# Altium project F4_Flight_Controller.PrjPcb
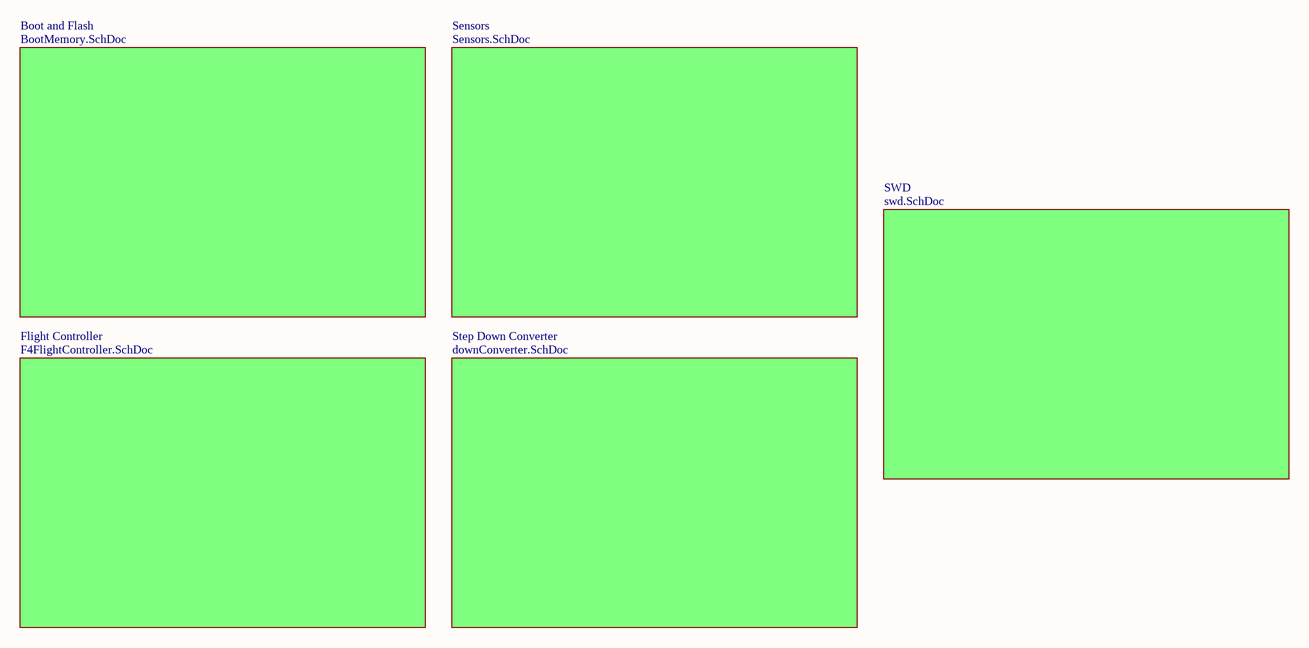
[diagram p0: Index.SchDoc]
6 sheets, 73 parts. Net scope: flat (ports and power ports of the same name join across sheets).
Board file: PCB1.PcbDoc
Sheets:
  Index.SchDoc
    Boot and Flash = BootMemory.SchDoc
    Sensors = Sensors.SchDoc
    Flight Controller = F4FlightController.SchDoc
    Step Down Converter = downConverter.SchDoc
    SWD = swd.SchDoc

## Sheet Index.SchDoc
size A4

### Sub-sheets
Boot and Flash = BootMemory.SchDoc: no entries
Flight Controller = F4FlightController.SchDoc: no entries
Sensors = Sensors.SchDoc: no entries
Step Down Converter = downConverter.SchDoc: no entries
SWD = swd.SchDoc: no entries

## Sheet BootMemory.SchDoc
size A4
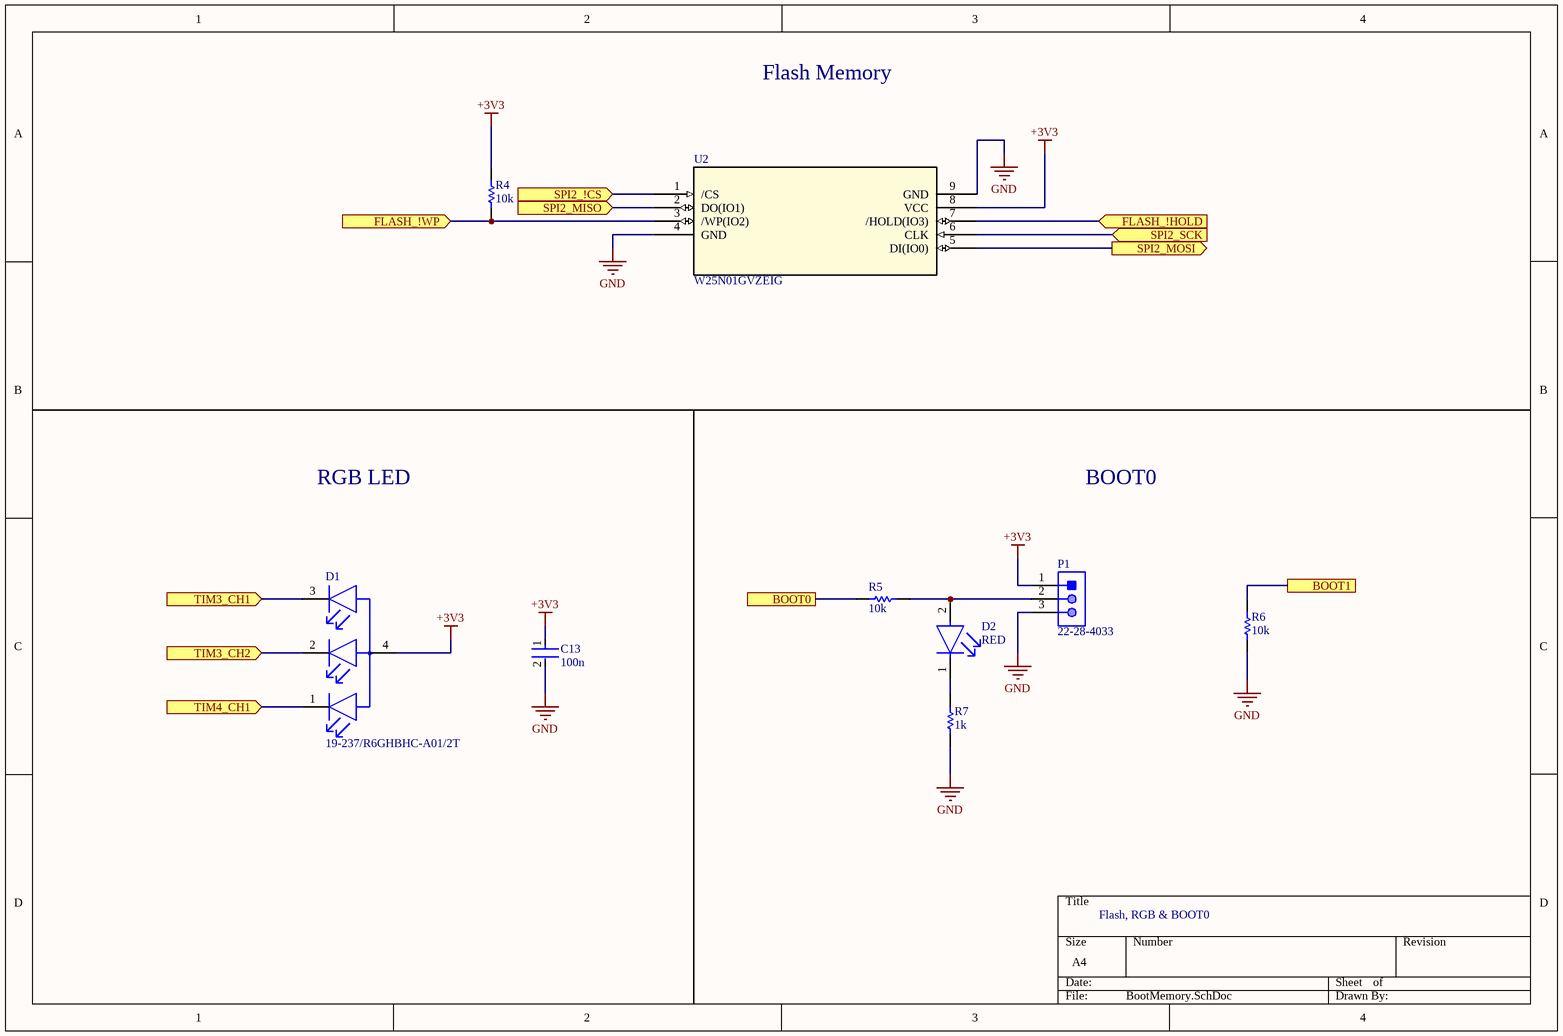
[diagram p1: BootMemory.SchDoc]

### Parts
C13  100n  [Capacitor 0402]
D1  19-237/R6GHBHC-A01/2T  [19337R6GHBHCA012T]
D2  RED  [FP-LTST-C190GKT-MFG]
P1  22-28-4033  [HDRV10W90P254_1X3_1270X483X840P]
R4  10k  [Resistor 0402]
R5  10k  [Resistor 0402]
R6  10k  [Resistor 0402]
R7  1k  [Resistor 0402]
U2  W25N01GVZEIG  [SON127P800X600X80-9N-D]

### Ports
BOOT0, BOOT1, FLASH_!HOLD (in), FLASH_!WP (in), SPI2_!CS (in), SPI2_MISO (in), SPI2_MOSI (out), SPI2_SCK (in), TIM3_CH1 (in), TIM3_CH2 (in), TIM4_CH1 (in)

### Nets
+3V3: C13.1 D1.4(COMMON_ANODE) P1.1 R4.2 U2.8(VCC)
GND: C13.2 P1.3 R6.2 R7.2 U2.4(GND) U2.9(GND)
BOOT0: R5.2 ; port BOOT0
BOOT1: R6.1 ; port BOOT1
FLASH_!HOLD: U2.7(/HOLD(IO3)) ; port FLASH_!HOLD
FLASH_!WP: R4.1 U2.3(/WP(IO2)) ; port FLASH_!WP
SPI2_!CS: U2.1(/CS) ; port SPI2_!CS
SPI2_MISO: U2.2(DO(IO1)) ; port SPI2_MISO
SPI2_MOSI: U2.5(DI(IO0)) ; port SPI2_MOSI
SPI2_SCK: U2.6(CLK) ; port SPI2_SCK
TIM3_CH1: D1.3(BLUE_C) ; port TIM3_CH1
TIM3_CH2: D1.2(GREEN_C) ; port TIM3_CH2
TIM4_CH1: D1.1(RED_C) ; port TIM4_CH1
NetD2_1: D2.1(C) R7.1
NetD2_2: D2.2(A) P1.2 R5.1

### Notes on the sheet
- Flash Memory
- RGB LED
- BOOT0
- Flash, RGB & BOOT0

### Library data of the parts
C13 = Capacitor 0402: Chip Capacitor 0402; Manufacturer Part Number: CC0402KRX7R7BB103; Manufacturer: Yageo; Automotive Grade: NA; Capacitance: 10 nF; Material: Ceramic; Value: 10 nF; Tolerance: 0.1; Temperature Characteristic: X7R; Voltage Rating: 16 V; Temperature Coefficient: 30ppm/°C; Temperature Range Low: -55°C; Temperature Range High: +125°C; Mouser Description: 0402 10 nF 16 V ±10 % Tolerance X7R SMT Multilayer Ceramic Capacitor; Footprint Url: http://www.yageo.com/exep/pages/download/literatures/UPY-C_GEN_24.pdf; Category: Cap; RoHS: TRUE; ComponentLink2Description: Datasheet; Ipc Land Pattern Name: CAPC10050X50; Automotive: No; ComponentLink2URL: http://www.yageo.com/documents/recent/UPY-GP_NP0_16V-to-50V_16.pdf; Device Class L1: Passive Components; Height: 0.55mm; Package: CC0402; Device Class L3: Ceramic Capacitors; Lead Free: Yes; Device Class L2: Capacitors; Digikey Description: CAP CER 10000PF 16V X7R 0402; Octopart: https://octopart.com/cc0402krx7r7bb103-yageo-192895; Temperature: -55°C to +125°C
D1 = LED RGB: LED RGB CLEAR CHIP SMD R/A; Manufacturer: Everlight; Manufacturer Part Number: 12-23A/R6GHBHC-A01/2D; Colour: Red, Green, Blue; Forward Current: 20mA; Forward Voltage: 2/3.3/3.3V; Viewing Angle: 120°; Led Orientation: Side View; Luminous Intensity: 90/180/72mcd; Wavelength: 624/525/470nm; Reverse Voltage: 5V; Peak Emmision Wavelength: 632/518/468nm; Power Dissipation: 60/110/110mW; Digikey Description: LED RGB CLEAR CHIP SMD R/A; Octopart: https://octopart.com/12-23a%2Fr6ghbhc-a01%2F2d-everlight-10561613; ComponentLink2Description: Datasheet; Lead Free: Yes; Device Class L2: LEDs; Automotive: No; Mouser Description: Standard LEDs - SMD RGB WATER CLEAR RIGHT ANGLE LENS; Category: Diode; Device Class L3: unset; Temperature Range Low: -40°C; Package: 12-23A; Device Class L1: Optoelectronics; Temperature Range High: +85°C; Height: 2.1mm; RoHS: TRUE; Temperature: -40°C to +85°C; ComponentLink2URL: https://media.digikey.com/pdf/Data%20Sheets/Everlight%20PDFs/12-23A,R6GHBHC-A01,2D.pdf
D2 = CMP-22017-000005-1: LED GREEN CLEAR CHIP SMD; Reverse Voltage: 5V; Power Dissipation: 100mW; Forward Voltage: 2.1V; Test Current: 10mA; Number of LEDs: 1; Viewing Angle: 130°; Forward Current: 30mA; Voltage: 2V; Wavelength: 565nm; Dominant Wavelength: 569nm; Luminous Intensity: 6mcd; Lens Color: Colorless; Packaging: Tape and Reel; Lens Transparency: Clear; Min Operating Temperature: -55°C; Case Code (Metric): 1608; Lens Style: Clear; Case/Package: 0603; Mount: Surface Mount; Package Quantity: 1; Height: 0.8mm; Illumination Color: Green; Radiation Hardening: No; Depth: 0.8mm; Number of Pins: 2; Max Operating Temperature: 85°C; Color: Green; Number of Elements: 1; Power Rating: 100mW; Case Code (Imperial): 0603; Width: 0.8mm; Length: 1.6mm; Lead Free: Lead Free
P1 = Male Header 01x03: Male Header, Pitch 2.54 mm, 1 x 3 Position, Height 8.38 mm, Tail Length 3.18 mm, RoHS, Bulk; Manufacturer: Molex; Rows: 1; Voltage Rating: 250 V; Current Rating: 4 A; Min Operating Temperature: 0 degC; Lead Pitch: 0.1 inch; Packaging: Bulk; Contact Finish: Gold; RoHSCompliant: true; Contact Material: Brass; PackageReference: 22-28-4033; REACH SVHC: Unknown; PackageDescription: Male Header, Pitch 2.54 mm, 1 x 3 Position, Height 8.38 mm, Tail Length 3.18 mm; ComponentLink2URL: http://www.molex.com/pdm_docs/sd/022284033_sd.pdf; Height: 8.38 mm; Mounting Technology: Through Hole; ComponentLink1Description: Manufacturer URL; Length: 7.62 mm; Mount: Through Hole; DatasheetVersion: Rev. G, 01/2012; Max Operating Temperature: 75 degC; ComponentLink2Description: Datasheet; Colour: Black; Pins: 3; Contact Plating: Gold; Package Quantity: 1; ComponentLink1URL: http://www.molex.com/; Manufacturer Part Number: 22-28-4033
R4-R7 = Resistor 0402: Chip Resistor 0402; Manufacturer: Vishay; Part Number: CRCW0402120RFKED; Manufacturer Part Number: CRCW0402120RFKED
U2 = W25N01GVZEIG: Flash memory; Vendor: Winbond; Built_By: EMA_Cory; SourceLibrary: Winbond_2020-02-06; Datasheet: https://www.winbond.com/resource-files/w25n01gv%20revl%20050918%20unsecured.pdf; Manufacturer_Part_Number: W25N01GVZEIG; Copyright: Copyright (C) 2018 Accelerated Designs. All rights reserved; RefDes: RefDes; Type: DEV

## Sheet Sensors.SchDoc
size A4
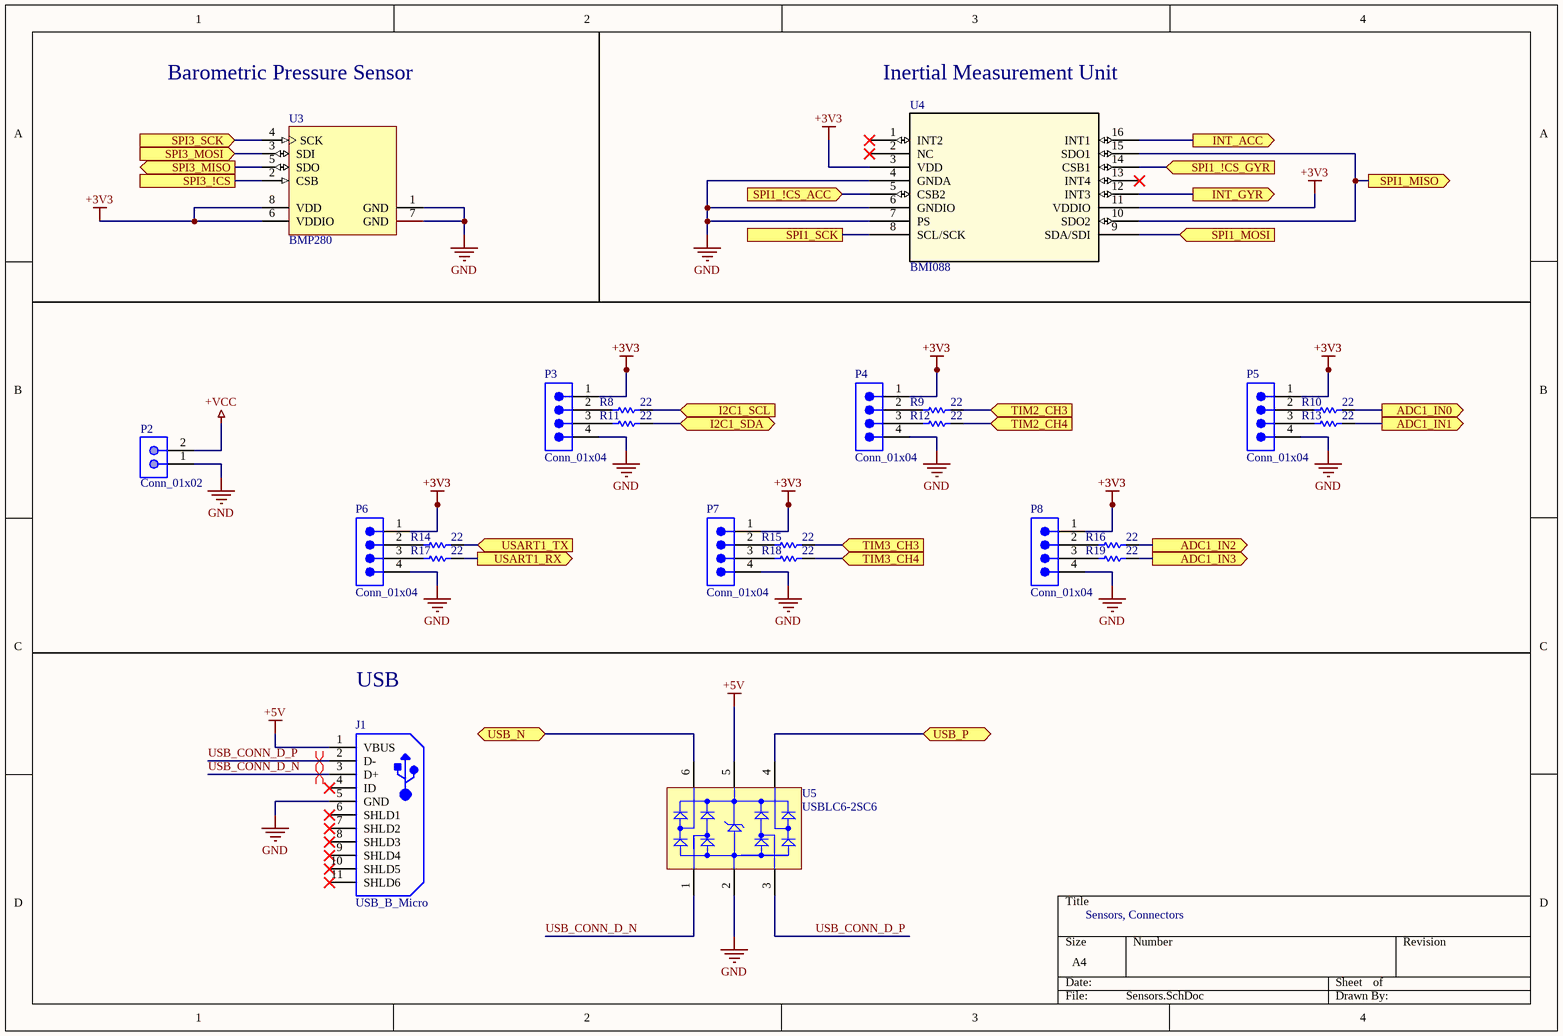
[diagram p2: Sensors.SchDoc]

### Parts
J1  USB_B_Micro  [MOLX-105133-0001_V]
P2  Conn_01x02  [HDRV10W90P254_1X2_1270X483X840P]
P3  Conn_01x04  [HDRV10W90P254_1X4_1270X483X840P]
P4  Conn_01x04  [HDRV10W90P254_1X4_1270X483X840P]
P5  Conn_01x04  [HDRV10W90P254_1X4_1270X483X840P]
P6  Conn_01x04  [HDRV10W90P254_1X4_1270X483X840P]
P7  Conn_01x04  [HDRV10W90P254_1X4_1270X483X840P]
P8  Conn_01x04  [HDRV10W90P254_1X4_1270X483X840P]
R8  22  [Resistor 0402]
R9  22  [Resistor 0402]
R10  22  [Resistor 0402]
R11  22  [Resistor 0402]
R12  22  [Resistor 0402]
R13  22  [Resistor 0402]
R14  22  [Resistor 0402]
R15  22  [Resistor 0402]
R16  22  [Resistor 0402]
R17  22  [Resistor 0402]
R18  22  [Resistor 0402]
R19  22  [Resistor 0402]
U3  BMP280  [8-PIN-METAL-LID-LGA]
U4  BMI088  [BMI088]
U5  USBLC6-2SC6  [SOT95P280X145-6N]

### Ports
ADC1_IN0 (out), ADC1_IN1 (out), ADC1_IN2 (out), ADC1_IN3 (out), I2C1_SCL (in), I2C1_SDA (bidir), INT_ACC (out), INT_GYR (out), SPI1_!CS_ACC (in), SPI1_!CS_GYR (in), SPI1_MISO (out), SPI1_MOSI (in), SPI1_SCK, SPI3_!CS, SPI3_MISO (out), SPI3_MOSI (in), SPI3_SCK (in), TIM2_CH3 (in), TIM2_CH4 (in), TIM3_CH3 (in), TIM3_CH4 (in), USART1_RX (out), USART1_TX (in), USB_N (bidir), USB_P (bidir)

### Nets
+3V3: P3.1 P4.1 P5.1 P6.1 P7.1 P8.1 U3.6(VDDIO) U3.8(VDD) U4.3(VDD) U4.11(VDDIO)
+5V: J1.1(VBUS) U5.5(VBUS)
+VCC: P2.2
GND: J1.5(GND) P2.1 P3.4 P4.4 P5.4 P6.4 P7.4 P8.4 U3.1(GND) U3.7(GND) U4.4(GNDA) U4.6(GNDIO) U4.7(PS) U5.2(GND)
ADC1_IN0: R10.1 ; port ADC1_IN0
ADC1_IN1: R13.1 ; port ADC1_IN1
ADC1_IN2: R16.1 ; port ADC1_IN2
ADC1_IN3: R19.1 ; port ADC1_IN3
I2C1_SCL: R8.1 ; port I2C1_SCL
I2C1_SDA: R11.1 ; port I2C1_SDA
INT_ACC: U4.16(INT1) ; port INT_ACC
INT_GYR: U4.12(INT3) ; port INT_GYR
SPI1_!CS_ACC: U4.5(CSB2) ; port SPI1_!CS_ACC
SPI1_!CS_GYR: U4.14(CSB1) ; port SPI1_!CS_GYR
SPI1_MISO: U4.10(SDO2) U4.15(SDO1) ; port SPI1_MISO
SPI1_MOSI: U4.9(SDA/SDI) ; port SPI1_MOSI
SPI1_SCK: U4.8(SCL/SCK) ; port SPI1_SCK
SPI3_!CS: U3.2(CSB) ; port SPI3_!CS
SPI3_MISO: U3.5(SDO) ; port SPI3_MISO
SPI3_MOSI: U3.3(SDI) ; port SPI3_MOSI
SPI3_SCK: U3.4(SCK) ; port SPI3_SCK
TIM2_CH3: R9.1 ; port TIM2_CH3
TIM2_CH4: R12.1 ; port TIM2_CH4
TIM3_CH3: R15.1 ; port TIM3_CH3
TIM3_CH4: R18.1 ; port TIM3_CH4
USART1_RX: R17.1 ; port USART1_RX
USART1_TX: R14.1 ; port USART1_TX
USB_CONN_D_N: J1.3(D+) U5.1(I/O_1)
USB_CONN_D_P: J1.2(D-) U5.3(I/O_2)
USB_N: U5.6(I/O_4) ; port USB_N
USB_P: U5.4(I/O_3) ; port USB_P
NetP3_2: P3.2 R8.2
NetP3_3: P3.3 R11.2
NetP4_2: P4.2 R9.2
NetP4_3: P4.3 R12.2
NetP5_2: P5.2 R10.2
NetP5_3: P5.3 R13.2
NetP6_2: P6.2 R14.2
NetP6_3: P6.3 R17.2
NetP7_2: P7.2 R15.2
NetP7_3: P7.3 R18.2
NetP8_2: P8.2 R16.2
NetP8_3: P8.3 R19.2

Not connected (* = marked no-connect by the designer): J1 4(ID)* 6(SHLD1)* 7(SHLD2)* 8(SHLD3)* 9(SHLD4)* 10(SHLD5)* 11(SHLD6)*; U4 1(INT2)* 2(NC)* 13(INT4)*

### Layout directives
differential pair: USB_CONN_D_N, USB_CONN_D_P

### Notes on the sheet
- Barometric Pressure Sensor
- Inertial Measurement Unit
- USB
- Sensors, Connectors

### Library data of the parts
J1 = USB_B_Micro: Micro USB B Type Receptacle, -55 to 85 degC, 5-Pin SMD, RoHS, Tape and Reel; Manufacturer: Amphenol FCI; Manufacturer Part Number: 10118193-0001LF; Insulation Resistance: 1000MOhms; Gender: Female; Current Rating: 1.8A; Number of Contacts: 5Contact; Connector Type: MicroUSBTypeBreceptacle; Brand: FCI; Mounting Angle: Right; Datasheet Version: Rev. C, 05/2015; Packaging: Reel; Product Category: USBConnectors; Standard: USB2.0; Factory Pack Quantity: 1200; Operating Temperature Range: -55Cto+85C; Termination Style: SMD/SMT; Datasheet URL: http://datasheet.octopart.com/10118193-0001LF-FCI-datasheet-55953155.pdf; Contact Material: CopperAlloy; RoHS: Details; Contact Plating: Gold; Flammability Rating: UL94V-0; Manufacturer URL: http://www.fci.com/; Product: MicroUSBTypeBConnectors; Color: Black
P2 = Male Header 01x02: Male Header, Pitch 2.54 mm, 1 x 2 Position, Height 8.21 mm, Tail Length 3.05 mm, -65 to 105 degC, RoHS, Bulk; Manufacturer: TE Connectivity; Manufacturer Part Number: 5-146280-2; Mating Connector Lock: No(Without); Number of Positions: 2; Pitch: 2.54mm; PCB Mounting Orientation: Vertical; Keyed: No; Case\/Package: 100; Mating Post Length: 0.23inch; High Temperature Housing: Yes; Max Current Rating: 5A; PCB Thickness: 0.063inch; PCB Mount Retention: Without; Approvals: CSA; Current Rating: 3A; Radiation Hardening: No; Length: 4.67mm; Contact Mating Length: 0.23inch; Connector Type: Header; Number of Rows: 1; Termination Post Length: 0.12inch; Board Standoff: No(Without); Max Operating Temperature: 105degC; Contact Shape: Square; Selectively Loaded: No(Without); Gasket: No(Without); Number of Contacts: 2; Contact Gender: Male; Mating Alignment: No(Without); Manufacturer URL: http://www.te.com/; Datasheet URL: http://www.te.com/commerce/DocumentDelivery/DDEController?Action=showdoc&DocId=Customer+Drawing%7F146280%7FH1%7Fpdf%7FEnglish%7FENG_CD_146280_H1.pdf%7F5-146280-2; Mount: ThroughHole; Orientation: Straight; Packaging: Carton; Package Reference: 5-146280-2; Package Quantity: 500; Stabilizers: No(Without); Row Spacing: 2.54mm; Contact Material: CopperAlloy; Panel Mount Retention: No(Without); Datasheet Version: Rev. H1, 08/2016; Housing Colour: Black; Colour: Black; Package Description: Male Header, Pitch 2.54 mm, 1 x 2 Position, Height 8.21 mm, Tail Length 3.05 mm; Contact Plating: Matte; Housing Material: Polymer; Contact Protection: No(Without); Min Operating Temperature: -65degC; Mounting Technology: ThroughHole; Flammability Rating: UL94V-0; RoHSCompliant: true; Termination: ThroughHole; Depth: 2.34mm; High Speed Serial Data Connector: No
P3-P8 = Male Header 01x04: Horizontal Surface Mount Header, -55 to 125 degC, 2 mm Pitch, 4-Pin, Male, RoHS; PartNumber: MMT-104-01-L-SH; Manufacturer: Samtec; Pitch: 2 mm; ComponentLink2Description: Datasheet; Temperature Range: -55 to 125 degC; DatasheetVersion: F-214; ComponentLink1Description: Manufacturer URL; ComponentLink3URL: http://www.samtec.com/documents/webfiles/cpdf/MMT-1XX-XX-XX-XX-XX-XXX-X-XX-MKT.pdf; ComponentLink3Description: Package Specification; RoHS: True; PackageDescription: 2mm Horizontal Terminal Surface Mount Strip ASSEM; Orientation: Horizontal; PackageVersion: CY, 12/2000; Mounting Technology: Surface Mount; ComponentLink2URL: http://d2a072wq521u33.cloudfront.net/catalog_english//MMT_SM.PDF; ComponentLink1URL: http://www.samtec.com; PackageReference: MMT-104-01-X-SH; Manufacturer Part Number: MMT-104-01-L-SH
R8-R19 = Resistor 0402: as R4 on sheet BootMemory; Manufacturer Part Number: CRCW0402120RFKED
U3 = BMP280: Digital Pressure Sensor,; Manufacturer: Bosch; Manufacturer URL: http://www.bosch-sensortec.com; Datasheet URL: http://datasheet.octopart.com/BMP280-Bosch-datasheet-41546027.pdf; Datasheet Version: Rev. 1.14, 05/2015; Manufacturer Part Number: BMP280
U4 = BMI088: Inertial Measurement Unit BOSCH; Built_By: EMA_Matt; SourceLibrary: Updates_to_database_2020-10-21; Vendor: Bosch; Manufacturer_Part_Number: BMI088; Copyright: Copyright (C) 2018 Accelerated Designs. All rights reserved; Revision: 1; RefDes: RefDes; Type: DEV
U5 = ESD protection: Very low capacitance ESD protection, 3.5 pF, -40 to 125 degC, 6-Pin SOT23, RoHS, Tape and Reel; Manufacturer: STMicroelectronics; Polarity: Uni-Directional; Clamping Voltage: 17V; Rad Hardened: No; Product Height (mm): 1.3mm; Leakage Current (Max): 0.15uA; Product Length (mm): 3.05mm; Number of Elements: 1; Peak Pulse Current: 5A; Configuration: Dual; Reverse Breakdown Voltage: 6V; Working Voltage (Max): 5V; Capacitance Value: 3.5pF; Suppressor Type: DiodeArrays; Product Depth (mm): 1.75mm; Test Current (It): 1mA; Package / Case: SOT-23; Operating Temperature Max Deg. C: 125C; Package Description: 6-Pin Small Outline Transistor, Body 2.925 x 1.625 mm, Pitch 0.95 mm; Package Reference: SOT23-6L; Datasheet Version: Rev. 5, 10/2011; Operating Temperature Min Deg. C: -40C; Mounting Style: SurfaceMount; Direction Type: Uni-Directional; Mounting: SurfaceMount; Pin Count: 6; Leakage Current: 0.15uA; Packaging: TapeandReel; Operating Temperature Classification: Automotive; Clamping Voltage (Max): 17V; Manufacturer URL: http://www.st.com/; Reverse Stand-off Voltage: 5V; Datasheet URL: http://www.st.com/st-web-ui/static/active/en/resource/technical/document/datasheet/CD00050750.pdf; Working Voltage: 5V; Operating Temp Range: -40Cto125C; Manufacturer Part Number: USBLC6-2SC6

## Sheet F4FlightController.SchDoc
size A4
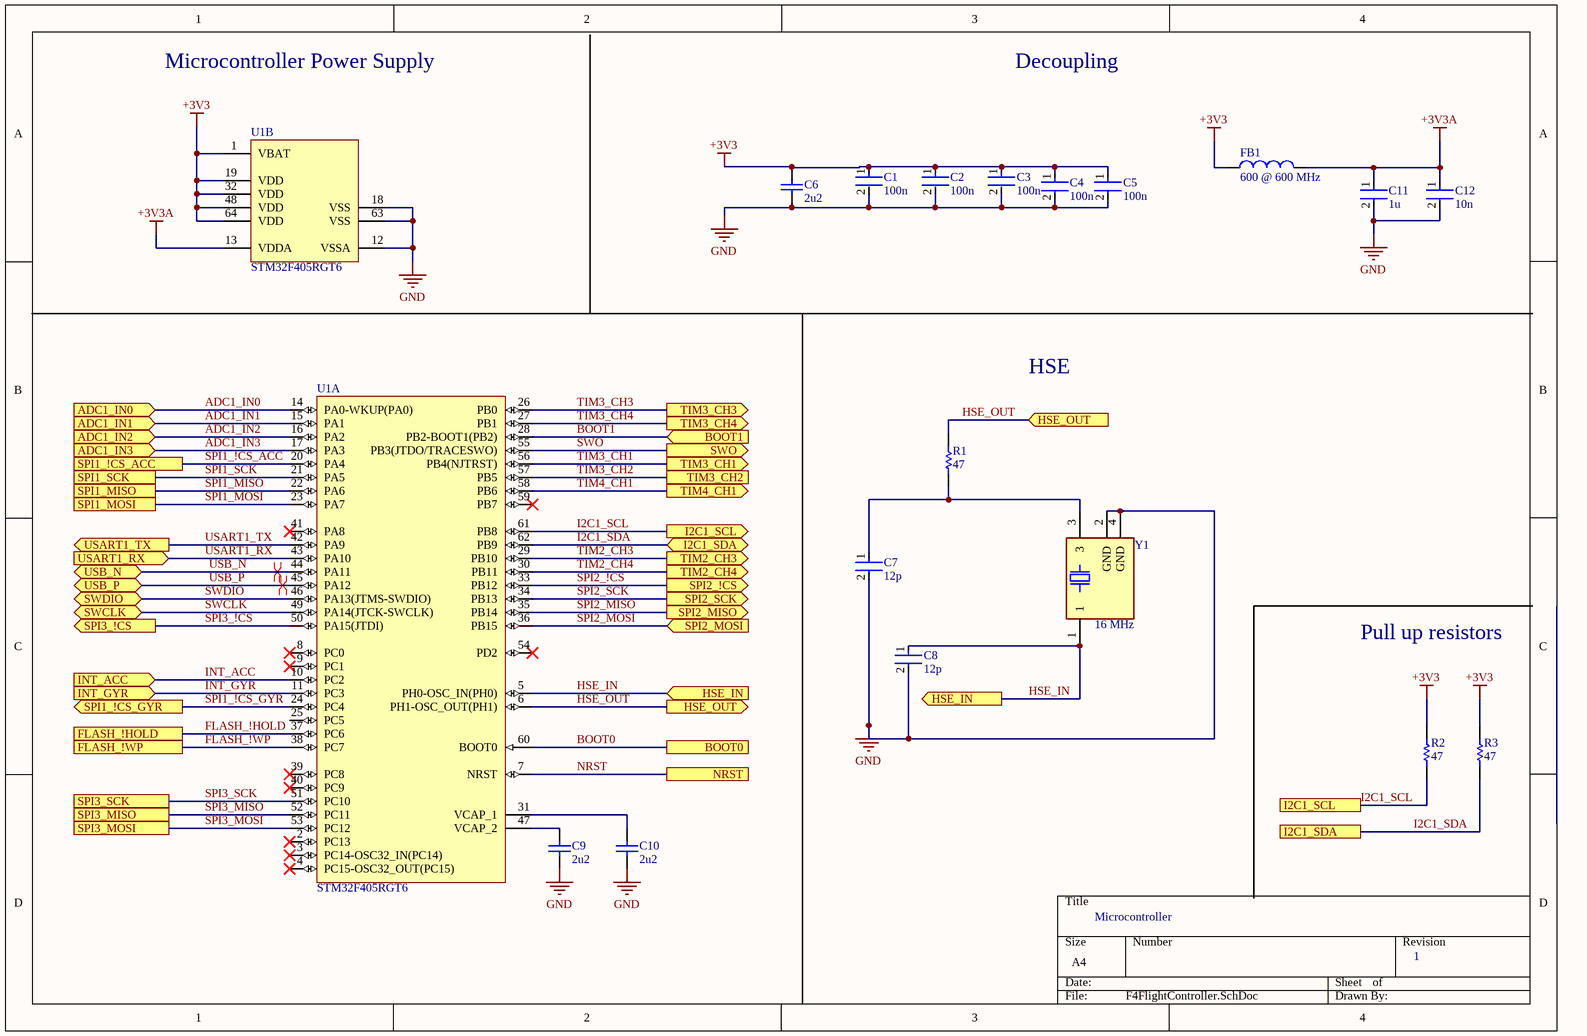
[diagram p3: F4FlightController.SchDoc]

### Parts
C1  100n  [Capacitor 0402]
C2  100n  [Capacitor 0402]
C3  100n  [Capacitor 0402]
C4  100n  [Capacitor 0402]
C5  100n  [Capacitor 0402]
C6  2u2  [CAPACITOR 0603]
C7  12p  [Capacitor 0402]
C8  12p  [Capacitor 0402]
C9  2u2  [CAPACITOR 0603]
C10  2u2  [CAPACITOR 0603]
C11  1u  [Capacitor 0402]
C12  10n  [Capacitor 0402]
FB1  600 @ 600 MHz  [Inductor 0805]
R1  47  [Resistor 0402]
R2  47  [Resistor 0402]
R3  47  [Resistor 0402]
U1  STM32F405RGT6  [STM-LQFP64_M]  (parts A,B of 2)
Y1  16 MHz  [XTAL_TSX-3225_16.0000MF18X-AC3]

### Ports
ADC1_IN0 (in), ADC1_IN1 (in), ADC1_IN2 (in), ADC1_IN3 (in), BOOT0, BOOT1 (in), FLASH_!HOLD, FLASH_!WP, HSE_IN (in), HSE_IN (out), HSE_OUT (in), HSE_OUT (out), I2C1_SCL, I2C1_SCL (out), I2C1_SDA, I2C1_SDA (bidir), INT_ACC (in), INT_GYR (in), NRST, SPI1_!CS_ACC, SPI1_!CS_GYR (out), SPI1_MISO, SPI1_MOSI, SPI1_SCK, SPI2_!CS (out), SPI2_MISO (out), SPI2_MOSI (in), SPI2_SCK (out), SPI3_!CS (out), SPI3_MISO, SPI3_MOSI, SPI3_SCK, SWCLK (bidir), SWDIO (bidir), SWO (out), TIM2_CH3 (out), TIM2_CH4 (out), TIM3_CH1 (out), TIM3_CH2, TIM3_CH3 (out), TIM3_CH4 (out), TIM4_CH1 (out), USART1_RX (in), USART1_TX (out), USB_N (bidir), USB_P (bidir)

### Nets
+3V3: C1.1 C2.1 C3.1 C4.1 C5.1 C6.2 FB1.1 R2.2 R3.2 U1.1(VBAT) U1.19(VDD) U1.32(VDD) U1.48(VDD) U1.64(VDD)
+3V3A: C11.1 C12.1 FB1.2 U1.13(VDDA)
GND: C1.2 C2.2 C3.2 C4.2 C5.2 C6.1 C7.2 C8.2 C9.1 C10.1 C11.2 C12.2 U1.12(VSSA) U1.18(VSS) U1.63(VSS) Y1.2(GND) Y1.4(GND)
ADC1_IN0: U1.14(PA0-WKUP(PA0)) ; port ADC1_IN0
ADC1_IN1: U1.15(PA1) ; port ADC1_IN1
ADC1_IN2: U1.16(PA2) ; port ADC1_IN2
ADC1_IN3: U1.17(PA3) ; port ADC1_IN3
BOOT0: U1.60(BOOT0) ; port BOOT0
BOOT1: U1.28(PB2-BOOT1(PB2)) ; port BOOT1
FLASH_!HOLD: U1.37(PC6) ; port FLASH_!HOLD
FLASH_!WP: U1.38(PC7) ; port FLASH_!WP
HSE_IN: C8.1 U1.5(PH0-OSC_IN(PH0)) Y1.1 ; port HSE_IN
HSE_OUT: R1.2 U1.6(PH1-OSC_OUT(PH1)) ; port HSE_OUT
I2C1_SCL: R2.1 U1.61(PB8) ; port I2C1_SCL
I2C1_SDA: R3.1 U1.62(PB9) ; port I2C1_SDA
INT_ACC: U1.10(PC2) ; port INT_ACC
INT_GYR: U1.11(PC3) ; port INT_GYR
NRST: U1.7(NRST) ; port NRST
SPI1_!CS_ACC: U1.20(PA4) ; port SPI1_!CS_ACC
SPI1_!CS_GYR: U1.24(PC4) ; port SPI1_!CS_GYR
SPI1_MISO: U1.22(PA6) ; port SPI1_MISO
SPI1_MOSI: U1.23(PA7) ; port SPI1_MOSI
SPI1_SCK: U1.21(PA5) ; port SPI1_SCK
SPI2_!CS: U1.33(PB12) ; port SPI2_!CS
SPI2_MISO: U1.35(PB14) ; port SPI2_MISO
SPI2_MOSI: U1.36(PB15) ; port SPI2_MOSI
SPI2_SCK: U1.34(PB13) ; port SPI2_SCK
SPI3_!CS: U1.50(PA15(JTDI)) ; port SPI3_!CS
SPI3_MISO: U1.52(PC11) ; port SPI3_MISO
SPI3_MOSI: U1.53(PC12) ; port SPI3_MOSI
SPI3_SCK: U1.51(PC10) ; port SPI3_SCK
SWCLK: U1.49(PA14(JTCK-SWCLK)) ; port SWCLK
SWDIO: U1.46(PA13(JTMS-SWDIO)) ; port SWDIO
SWO: U1.55(PB3(JTDO/TRACESWO)) ; port SWO
TIM2_CH3: U1.29(PB10) ; port TIM2_CH3
TIM2_CH4: U1.30(PB11) ; port TIM2_CH4
TIM3_CH1: U1.56(PB4(NJTRST)) ; port TIM3_CH1
TIM3_CH2: U1.57(PB5) ; port TIM3_CH2
TIM3_CH3: U1.26(PB0) ; port TIM3_CH3
TIM3_CH4: U1.27(PB1) ; port TIM3_CH4
TIM4_CH1: U1.58(PB6) ; port TIM4_CH1
USART1_RX: U1.43(PA10) ; port USART1_RX
USART1_TX: U1.42(PA9) ; port USART1_TX
USB_N: U1.44(PA11) ; port USB_N
USB_P: U1.45(PA12) ; port USB_P
NetC7_1: C7.1 R1.1 Y1.3
NetC9_2: C9.2 U1.47(VCAP_2)
NetC10_2: C10.2 U1.31(VCAP_1)

Not connected (* = marked no-connect by the designer): U1 2(PC13)* 3(PC14-OSC32_IN(PC14))* 4(PC15-OSC32_OUT(PC15))* 8(PC0)* 9(PC1)* 25(PC5) 39(PC8)* 40(PC9)* 41(PA8)* 54(PD2)* 59(PB7)*

### Layout directives
differential pair: USB_N, USB_P

### Notes on the sheet
- Microcontroller Power Supply
- Decoupling
- HSE
- Pull up resistors
- Microcontroller
- 1

### Library data of the parts
C1-C5 = Capacitor 0402: Chip Capacitor 0402; Manufacturer Part Number: CC0402KRX7R7BB103; Manufacturer: YAGEO; Automotive Grade: NA; Capacitance: 10 nF; Material: Ceramic; Value: 10 nF; Tolerance: 0.1; Temperature Characteristic: X7R; Voltage Rating: 16 V; Temperature Coefficient: 30ppm/°C; Temperature Range Low: -55°C; Temperature Range High: +125°C; Mouser Description: 0402 10 nF 16 V ±10 % Tolerance X7R SMT Multilayer Ceramic Capacitor; Footprint Url: http://www.yageo.com/exep/pages/download/literatures/UPY-C_GEN_24.pdf; Category: Cap; RoHS: TRUE; ComponentLink2Description: Datasheet; Ipc Land Pattern Name: CAPC10050X50; Automotive: No; ComponentLink2URL: http://www.yageo.com/documents/recent/UPY-GP_NP0_16V-to-50V_16.pdf; Device Class L1: Passive Components; Height: 0.55mm; Package: CC0402; Device Class L3: Ceramic Capacitors; Lead Free: Yes; Device Class L2: Capacitors; Digikey Description: CAP CER 10000PF 16V X7R 0402; Octopart: https://octopart.com/cc0402krx7r7bb103-yageo-192895; Temperature: -55°C to +125°C; Manufacturer: Yageo
C6 = Chip Capacitor 0603: Chip Capacitor, 22 pF, +/- 5%, 50 V, -55 to 125 degC, 0603 (1608 Metric), RoHS, Tape and Reel; Manufacturer: Murata; Manufacturer Part Number: GRM1885C1H220JA01D; Capacitance: 22pF; Rated Voltage: 50V; Dielectric: C0G; Manufacturer URL: http://www.murata.com/; Datasheet Version: Jul-06; Package Reference: 603; Tolerance (%): ±5%; Case Size/Dimension: 0603; Package Description: 2-Pin Surface Mount Device, Body 1.6 x 0.8 mm; Datasheet URL: https://datasheet.ciiva.com/11786/0900766b807a1cab-11786398.pdf
C7 C8 C11 C12 = Capacitor 0402: as C13 on sheet BootMemory; Temperature Range Low: -55°C; Temperature Range High: +125°C; Mouser Description: 0402 10 nF 16 V ±10 % Tolerance X7R SMT Multilayer Ceramic Capacitor; Footprint Url: http://www.yageo.com/exep/pages/download/literatures/UPY-C_GEN_24.pdf; Category: Cap; RoHS: TRUE; ComponentLink2Description: Datasheet; Ipc Land Pattern Name: CAPC10050X50; Automotive: No; ComponentLink2URL: http://www.yageo.com/documents/recent/UPY-GP_NP0_16V-to-50V_16.pdf; Device Class L1: Passive Components; Height: 0.55mm; Package: CC0402; Device Class L3: Ceramic Capacitors; Lead Free: Yes; Device Class L2: Capacitors; Digikey Description: CAP CER 10000PF 16V X7R 0402; Octopart: https://octopart.com/cc0402krx7r7bb103-yageo-192895; Temperature: -55°C to +125°C
C9 C10 = Capacitor 0603: Chip Capacitor, 22 pF, +/- 5%, 50 V, -55 to 125 degC, 0603 (1608 Metric), RoHS, Tape and Reel; Manufacturer: Murata; Manufacturer Part Number: GRM1885C1H220JA01D; Capacitance: 22pF; Rated Voltage: 50V; Dielectric: C0G; Manufacturer URL: http://www.murata.com/; Datasheet Version: Jul-06; Package Reference: 603; Tolerance (%): ±5%; Case Size/Dimension: 0603; Package Description: 2-Pin Surface Mount Device, Body 1.6 x 0.8 mm; Datasheet URL: https://datasheet.ciiva.com/11786/0900766b807a1cab-11786398.pdf
FB1 = Ferrite Bead: Ferrite Bead Murata BLM21AG601SN1D; Manufacturer: TDK; Manufacturer Part Number: MLZ2012A1R0MT000; Tolerance (%): 20%; DC Resistance: 0.6; Inductance-Nom: 10H; Rated Current-Max: 100mA; Package Reference: IND0805; Case Size/Dimension: 0805; Manufacturer URL: http://www.murata.com/; Package Description: 2-Pin Surface Mount Device, Body 2 x 1.25 mm; Datasheet URL: http://psearch.en.murata.com/inductor/product/LQM21FN100M70%23.pdf; Mounting Technology: SurfaceMount; Datasheet Version: 05/2016
R1-R3 = Resistor 0402: as R4 on sheet BootMemory; Manufacturer Part Number: CRCW0402120RFKED
U1 = STM32 ARM Cortex-M4: ARM Cortex-M4 32-bit MCU+FPU, 210 DMIPS, 1024 kB Flash, 192 kB Internal RAM, 51 I/Os, 64-pin LQFP, -40 to 85 degC, Tray; Manufacturer: STMicroelectronics; Supply Voltage(Vcc) min (V): 1.8; Supply Voltage(Vcc) max (V): 3.6; Internal RAM Size (kB): 192; I/Os (High Current): 51; D/A Converter: 2x12-bit; FLASH Size (Prog) (kB): 1024; Operating Frequency(F) (Processor speed) (MHz): 168; ComponentLink2Description: Datasheet; PackageVersion: Rev. 4, 06/2013; DatasheetVersion: Rev. 4; Core: ARM Cortex-M4; ComponentLink2URL: http://www.st.com/st-web-ui/static/active/en/resource/technical/document/datasheet/DM00037051.pdf; PackageReference: LQFP64; Packing: Tray; ComponentLink1Description: Manufacturer URL; ComponentLink3URL: http://www.st.com/st-web-ui/static/active/en/resource/technical/document/datasheet/DM00037051.pdf; ComponentLink3Description: Package Specification; Mounting Technology: Surface Mount; ComponentLink1URL: http://www.st.com/web/en/home.html; PackageDescription: 64-Pin Low Profile Quad Flat Package, 10 x 10 mm Body, 0.5 mm Pitch; PartNumber: STM32F405RGT6; Manufacturer Part Number: STM32F405RGT6
Y1 = TSX-3225_16.0000MF18X-AC3: 16MHz Â±10ppm Crystal 9pF 60 Ohms 4-SMD, No Lead; MP: TSX-3225 16.0000MF18X-AC3; MF: EPSON; Availability: Unavailable; Package: SMD-4 Epson; SnapEDA_Link: https://www.snapeda.com/parts/TSX-3225%2016.0000MF18X-AC3/EPSON/view-part/105674/?ref=snap; Value: *; Price: None

## Sheet downConverter.SchDoc
size A4
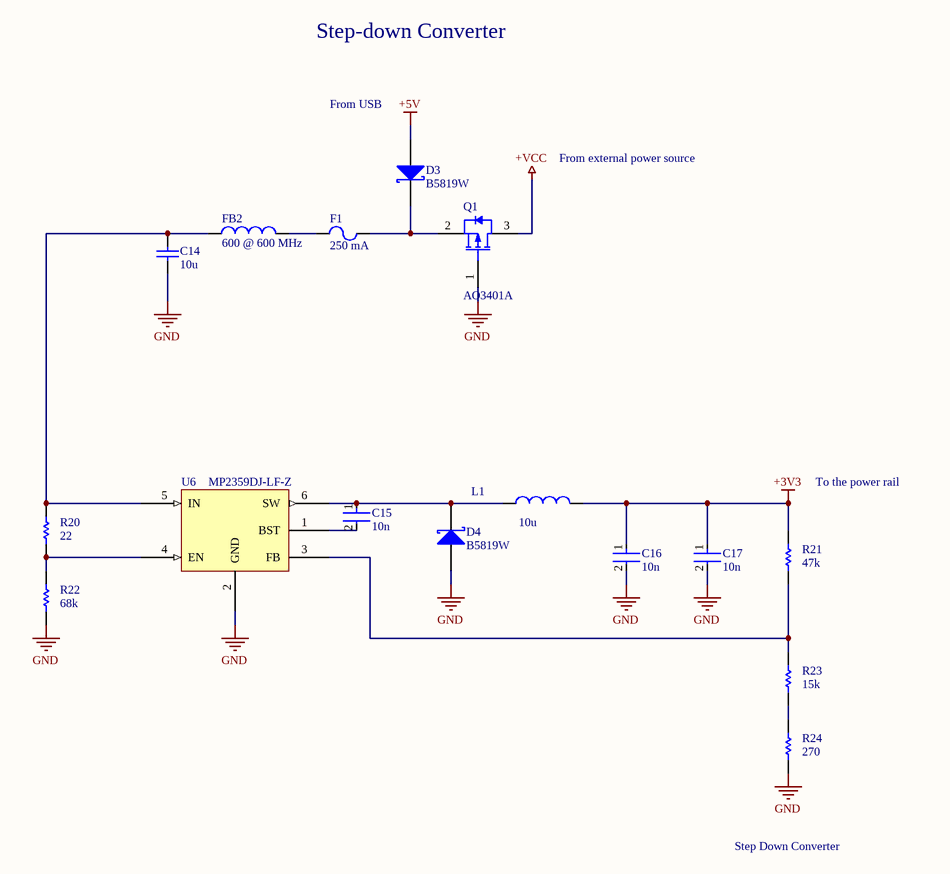
[diagram p4: downConverter.SchDoc]

### Parts
C14  10u  [Capacitor 1206]
C15  10n  [Capacitor 0402]
C16  10n  [Capacitor 0402]
C17  10n  [Capacitor 0402]
D3  B5819W  [SOD3716X135N]
D4  B5819W  [SOD3716X135N]
F1  250 mA  [Fuse 1206]
FB2  600 @ 600 MHz  [Inductor 0805]
L1  10u  [LQH32DN100K23L]
Q1  AO3401A  [SOT95P245X110-3N]
R20  22  [RESISTOR 0603]
R21  47k  [RESISTOR 0603]
R22  68k  [RESISTOR 0603]
R23  15k  [RESISTOR 0603]
R24  270  [RESISTOR 0603]
U6  MP2359DJ-LF-Z  [SOT95P280X100-6N]

### Nets
+3V3: C16.1 C17.1 L1.2 R21.2
+5V: D3.1(A)
+VCC: Q1.3(DRAIN)
GND: C14.1 C16.2 C17.2 D4.1(A) Q1.1(GATE) R22.1 R24.1 U6.2(GND)
NetC14_2: C14.2 FB2.1 R20.2 U6.5(IN)
NetC15_1: C15.1 D4.2(K) L1.1 U6.6(SW)
NetC15_2: C15.2 U6.1(BST)
NetD3_2: D3.2(K) F1.2 Q1.2(SOURCE)
NetF1_1: F1.1 FB2.2
NetR20_1: R20.1 R22.2 U6.4(EN)
NetR21_1: R21.1 R23.2 U6.3(FB)
NetR23_1: R23.1 R24.2

### Notes on the sheet
- Step-down Converter
- From USB
- From external power source
- To the power rail
- Step Down Converter

### Library data of the parts
C14 = Capacitor 1206: Chip Capacitor, 1206; Manufacturer: Murata; Manufacturer Part Number: GRM1885C1H220JA01D; Capacitance: 22pF; Tolerance (%): ±5%; Rated Voltage: 50V; Dielectric: C0G; Manufacturer URL: http://www.murata.com/; Datasheet Version: Jul-06; Package Reference: 603; Case Size/Dimension: 0603; Package Description: 2-Pin Surface Mount Device, Body 1.6 x 0.8 mm; Datasheet URL: https://datasheet.ciiva.com/11786/0900766b807a1cab-11786398.pdf
C15-C17 = Capacitor 0402: as C13 on sheet BootMemory; Temperature Range Low: -55°C; Temperature Range High: +125°C; Mouser Description: 0402 10 nF 16 V ±10 % Tolerance X7R SMT Multilayer Ceramic Capacitor; Footprint Url: http://www.yageo.com/exep/pages/download/literatures/UPY-C_GEN_24.pdf; Category: Cap; RoHS: TRUE; ComponentLink2Description: Datasheet; Ipc Land Pattern Name: CAPC10050X50; Automotive: No; ComponentLink2URL: http://www.yageo.com/documents/recent/UPY-GP_NP0_16V-to-50V_16.pdf; Device Class L1: Passive Components; Height: 0.55mm; Package: CC0402; Device Class L3: Ceramic Capacitors; Lead Free: Yes; Device Class L2: Capacitors; Digikey Description: CAP CER 10000PF 16V X7R 0402; Octopart: https://octopart.com/cc0402krx7r7bb103-yageo-192895; Temperature: -55°C to +125°C
D3 D4 = Schottky Barrier Rectifier: Schottky Barrier Rectifier, 20 V, 1 A, -65 to 150 degC, 2-Pin DO-214AC (SMA), RoHS, Tape and Reel; Manufacturer: Vishay Intertechnology; Manufacturer Part Number: SS12-E3\61T; Max Surge Current: 40A; Forward Voltage: 500mV; Forward Current: 1A; Peak Reverse Current: 6mA; Package Quantity: 1800; Datasheet URL: http://www.vishay.com/docs/88746/ss12.pdf; Case/Package: SMA; Package Description: 2-Pin Surface Mount Device, Body 4.245 x 2.665 mm; Pins: 2; Mounting Technology: SM; Min Operating Temperature: -65°C; Packaging: TapeandReel; Datasheet Version: Aug-15; Manufacturer URL: http://www.vishay.com/; RoHS Compliant: True; Package Reference: DO-214AC (SMA); Max Operating Temperature: 125°C; Component Type: Diodes
F1 = Fuse 1206: NANO2(R) Slo-Blo(R) Fuse, 0.5 A, 125 V, -55 to 125 degC, 2-Pin SMD, RoHS, Tape and Reel; Manufacturer: Littelfuse; Manufacturer Part Number: 0452.500MRL; Current Rating: 0.5A; Working Voltage-Max: 125V; Manufacturer URL: http://www.littelfuse.com/; Operating Temp Range: -55to+125°C; Package Reference: 0452; Mounting Technology: SurfaceMount; Datasheet Version: 07/2015; Response Characteristic: Slo-Blo; Datasheet URL: http://download.siliconexpert.com/pdfs/2015/7/2/10/39/10/885/ltf_/manual/4322647674859060843226474844920160littelfuse_fuse_452_454_datasheet.pdf.pdf.pdf; Size: 6.10x2.69mm; Package Description: 2-Pin Surface Mount Device, Body 6.1 x 2.69 mm
FB2 = Ferrite Bead: as FB1 on sheet F4FlightController; Package Reference: IND0805; Case Size/Dimension: 0805; Manufacturer URL: http://www.murata.com/; Package Description: 2-Pin Surface Mount Device, Body 2 x 1.25 mm; Datasheet URL: http://psearch.en.murata.com/inductor/product/LQM21FN100M70%23.pdf; Mounting Technology: SurfaceMount; Datasheet Version: 05/2016
L1 = Fixed Inductor: LQH32CN100K33L 10uh; Manufacturer: TDK; Manufacturer Part Number: MLZ2012A1R0MT000; Tolerance (%): 20%; DC Resistance: 0.6; Inductance-Nom: 10H; Rated Current-Max: 100mA; Package Reference: IND0805; Case Size/Dimension: 0805; Manufacturer URL: http://www.murata.com/; Package Description: 2-Pin Surface Mount Device, Body 2 x 1.25 mm; Datasheet URL: http://psearch.en.murata.com/inductor/product/LQM21FN100M70%23.pdf; Mounting Technology: SurfaceMount; Datasheet Version: 05/2016
Q1 = P-Channel MOSFET: P-Channel MOSFET, 30 V, 4 A, -55 to 150 degC, 3-Pin SOT-23-3L, RoHS, Tape and Reel; Manufacturer: Alpha & Omega Semiconductor; Output Power (Max): NotRequiredW; Power Dissipation: 1.4W; Rad Hardened: No; Drain Efficiency: NotRequired%; Drain-Source On-Volt: 30V; Noise Figure: NotRequireddB; Frequency (Max): NotRequiredMHz; Number of  Elements: 1; Gate-Source Voltage (Max): ?12V; Drain Current (Max): 4A; Channel Mode: Enhancement; Drain-Source On-Res: 0.044ohm; Type: PowerMOSFET; Polarity: P; Package URL: http://www.aosmd.com/res/packaging_information/SOT-23-3L.pdf; Datasheet URL: http://www.aosmd.com/res/data_sheets/AO3401A.pdf; Package Type: SOT-23; Package Description: 3-Pin Small Outline Transistor, Body 2.95 x 1.6 mm, Pitch 0.95 mm; Mounting: SurfaceMount; Manufacturer URL: http://www.aosmd.com/; Continuous Drain Current: 4A; Package Reference: SOT-23-3L; Mounting Technology: SurfaceMount; Operating Temperature Classification: Military; Power Gain: NotRequireddB; Datasheet Version: Rev. 3, 03/2011; Operating Temp Range: -55Cto150C; Pin Count: 3; Manufacturer Part Number: AO3401A
R20-R24 = Resistor 0603: Chip Resistor 0603; Manufacturer: Vishay; Part Number: CRCW0402120RFKED; Manufacturer Part Number: CRCW0402120RFKED
U6 = MP2359DJ-LF-Z: Regulator

## Sheet swd.SchDoc
size A4
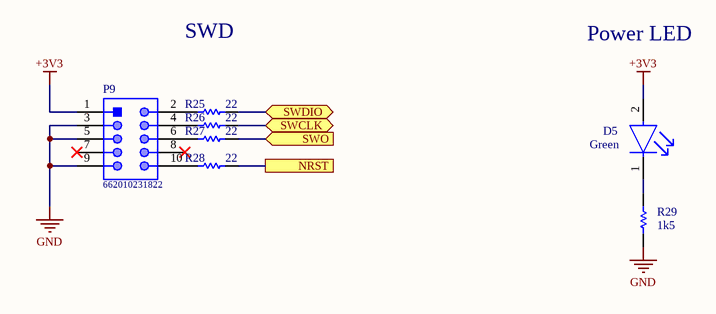
[diagram p5: swd.SchDoc]

### Parts
D5  Green  [Led 0603]
P9  662010231822  [HDRV10W90P254_2X5_1270X483X840P]
R25  22  [Resistor 0402]
R26  22  [Resistor 0402]
R27  22  [Resistor 0402]
R28  22  [Resistor 0402]
R29  1k5  [RESISTOR 0603]

### Ports
NRST, SWCLK (bidir), SWDIO (bidir), SWO (in)

### Nets
+3V3: D5.2(A) P9.1
GND: P9.3 P9.5 P9.9 R29.1
NRST: R28.1 ; port NRST
SWCLK: R26.1 ; port SWCLK
SWDIO: R25.1 ; port SWDIO
SWO: R27.1 ; port SWO
NetD5_1: D5.1(C) R29.2
NetP9_2: P9.2 R25.2
NetP9_4: P9.4 R26.2
NetP9_6: P9.6 R27.2
NetP9_10: P9.10 R28.2

Not connected (* = marked no-connect by the designer): P9 7* 8*

### Notes on the sheet
- SWD
- Power LED

### Library data of the parts
D5 = LED 0805: Manufacturer: Vishay Lite-On; Manufacturer Part Number: LTST-C190GKT; Lens Transparency: Clear; Reverse Voltage: 5V; Power Dissipation: 100mW; Forward Voltage: 2.1V; Test Current: 10mA; Number of LEDs: 1; Viewing Angle: 130°; Forward Current: 30mA; Voltage: 2V; Wavelength: 565nm; Dominant Wavelength: 569nm; Luminous Intensity: 6mcd; Lens Color: Colorless; Packaging: Tape and Reel; Min Operating Temperature: -55°C; Case Code (Metric): 1608; Lens Style: Clear; Case/Package: 0603; Mount: Surface Mount; Package Quantity: 1; Height: 0.8mm; Illumination Color: Green; Radiation Hardening: No; Depth: 0.8mm; Number of Pins: 2; Max Operating Temperature: 85°C; Color: Green; Number of Elements: 1; Power Rating: 100mW; Case Code (Imperial): 0603; Width: 0.8mm; Length: 1.6mm; Lead Free: Lead Free
P9 = Male Header 02x05: SMT Male Header WR-MPC3, with SMT Solder Tabs, Vertical, Dual Row, pitch 3 mm, 10 pins; Manufacturer: Wurth Electronics; Working Voltage: 250VAC; Pin Number: 10; Contact Resistance: 10mOhm; Pitch: 3mm; Gender: Male; Publisher: WurthElektronik; Datasheet URL: https://katalog.we-online.de/em/datasheet/6620xx231822.pdf; Mounting Technology: SMT; Packaging: Tray; Operating Temperature: -40to105degC; Package Reference: 662010231822; Orientation: Vertical; Part Number: 662010231822; Manufacturer URL: http://www.we-online.de; Manufacturer Part Number: 662010231822
R25-R28 = Resistor 0402: as R4 on sheet BootMemory; Manufacturer Part Number: CRCW0402120RFKED
R29 = Resistor 0603: as R20 on sheet downConverter; Manufacturer Part Number: CRCW0402120RFKED

## Nets that join several sheets
+3V3: BootMemory (5 pins), Sensors (10 pins), F4FlightController (14 pins), downConverter (C16.1 C17.1 L1.2 R21.2), swd (D5.2 P9.1)
+5V: Sensors (J1.1 U5.5), downConverter (D3.1)
+VCC: Sensors (P2.2), downConverter (Q1.3)
GND: BootMemory (6 pins), Sensors (14 pins), F4FlightController (17 pins), downConverter (8 pins), swd (P9.3 P9.5 P9.9 R29.1)
ADC1_IN0: Sensors (R10.1), F4FlightController (U1.14)
ADC1_IN1: Sensors (R13.1), F4FlightController (U1.15)
ADC1_IN2: Sensors (R16.1), F4FlightController (U1.16)
ADC1_IN3: Sensors (R19.1), F4FlightController (U1.17)
BOOT0: BootMemory (R5.2), F4FlightController (U1.60)
BOOT1: BootMemory (R6.1), F4FlightController (U1.28)
FLASH_!HOLD: BootMemory (U2.7), F4FlightController (U1.37)
FLASH_!WP: BootMemory (R4.1 U2.3), F4FlightController (U1.38)
I2C1_SCL: Sensors (R8.1), F4FlightController (R2.1 U1.61)
I2C1_SDA: Sensors (R11.1), F4FlightController (R3.1 U1.62)
INT_ACC: Sensors (U4.16), F4FlightController (U1.10)
INT_GYR: Sensors (U4.12), F4FlightController (U1.11)
NRST: F4FlightController (U1.7), swd (R28.1)
SPI1_!CS_ACC: Sensors (U4.5), F4FlightController (U1.20)
SPI1_!CS_GYR: Sensors (U4.14), F4FlightController (U1.24)
SPI1_MISO: Sensors (U4.10 U4.15), F4FlightController (U1.22)
SPI1_MOSI: Sensors (U4.9), F4FlightController (U1.23)
SPI1_SCK: Sensors (U4.8), F4FlightController (U1.21)
SPI2_!CS: BootMemory (U2.1), F4FlightController (U1.33)
SPI2_MISO: BootMemory (U2.2), F4FlightController (U1.35)
SPI2_MOSI: BootMemory (U2.5), F4FlightController (U1.36)
SPI2_SCK: BootMemory (U2.6), F4FlightController (U1.34)
SPI3_!CS: Sensors (U3.2), F4FlightController (U1.50)
SPI3_MISO: Sensors (U3.5), F4FlightController (U1.52)
SPI3_MOSI: Sensors (U3.3), F4FlightController (U1.53)
SPI3_SCK: Sensors (U3.4), F4FlightController (U1.51)
SWCLK: F4FlightController (U1.49), swd (R26.1)
SWDIO: F4FlightController (U1.46), swd (R25.1)
SWO: F4FlightController (U1.55), swd (R27.1)
TIM2_CH3: Sensors (R9.1), F4FlightController (U1.29)
TIM2_CH4: Sensors (R12.1), F4FlightController (U1.30)
TIM3_CH1: BootMemory (D1.3), F4FlightController (U1.56)
TIM3_CH2: BootMemory (D1.2), F4FlightController (U1.57)
TIM3_CH3: Sensors (R15.1), F4FlightController (U1.26)
TIM3_CH4: Sensors (R18.1), F4FlightController (U1.27)
TIM4_CH1: BootMemory (D1.1), F4FlightController (U1.58)
USART1_RX: Sensors (R17.1), F4FlightController (U1.43)
USART1_TX: Sensors (R14.1), F4FlightController (U1.42)
USB_N: Sensors (U5.6), F4FlightController (U1.44)
USB_P: Sensors (U5.4), F4FlightController (U1.45)